# Altium schematic sheet Connectors.SchDoc
size A; SheetNumber: 6; SheetTotal: 8
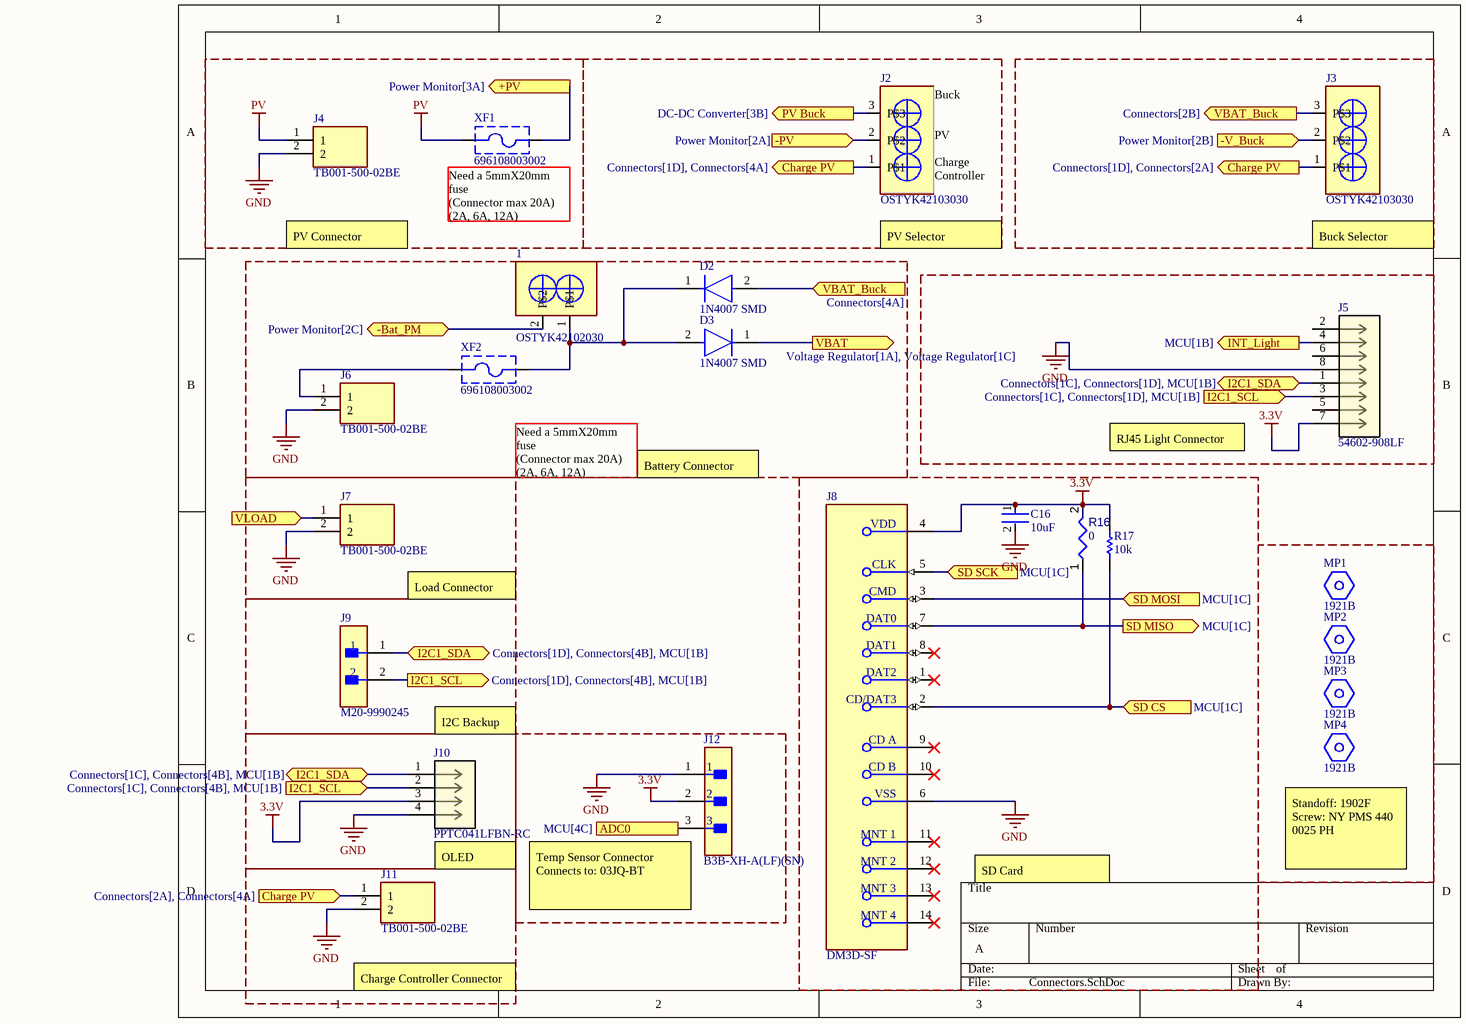
[diagram p0: Connectors.SchDoc]

## Parts
1  OSTYK42102030  [OSTYK42102030]
C16  10uF  [FP-GRM188-0_1-e0_2_0_55-IPC_A]
D2  1N4007 SMD  [FP-1N4007_SMD-IPC_C]
D3  1N4007 SMD  [FP-1N4007_SMD-IPC_C]
J2  OSTYK42103030  [OSTYK42103030]
J3  OSTYK42103030  [OSTYK42103030]
J4  TB001-500-02BE  [CUI_TB001-500-02BE]
J5  54602-908LF  [CONN8_2-908LF_AMP]
J6  TB001-500-02BE  [CUI_TB001-500-02BE]
J7  TB001-500-02BE  [CUI_TB001-500-02BE]
J8  DM3D-SF  [FP-DM3D-SF-MFG]
J9  M20-9990245  [FP-M20-9990245-MFG]
J10  PPTC041LFBN-RC  [CONN_PPTC041LFBN-RC_SUL]
J11  TB001-500-02BE  [CUI_TB001-500-02BE]
J12  B3B-XH-A(LF)(SN)  [FP-B3B-XH-A_LF_SN-MFG]
MP1  1921B  [FP-1921B-MFG]
MP2  1921B  [FP-1921B-MFG]
MP3  1921B  [FP-1921B-MFG]
MP4  1921B  [FP-1921B-MFG]
R16  value 0  [RESC0603(1608)_L]  (hidden comment: 0R3J)
R17  10k  [RESC1609X50X30NL8T20]
XF1  696108003002  [696108003002]
XF2  696108003002  [696108003002]

## Ports
+PV (out, see Power Monitor[3A]), -Bat_PM (bidir, see Power Monitor[2C]), -PV (in, see Power Monitor[2A]), -V_Buck (in, see Power Monitor[2B]), ADC0 (see MCU[4C]), Charge PV (in, see Connectors[2A], Connectors[4A]), Charge PV (out, see Connectors[1D], Connectors[2A]), Charge PV (out, see Connectors[1D], Connectors[4A]), I2C1_SCL (in, see Connectors[1C], Connectors[1D], MCU[1B]), I2C1_SCL (in, see Connectors[1C], Connectors[4B], MCU[1B]), I2C1_SCL (out, see Connectors[1D], Connectors[4B], MCU[1B]), I2C1_SDA (bidir, see Connectors[1C], Connectors[1D], MCU[1B]), I2C1_SDA (bidir, see Connectors[1C], Connectors[4B], MCU[1B]), I2C1_SDA (bidir, see Connectors[1D], Connectors[4B], MCU[1B]), INT_Light (out, see MCU[1B]), PV Buck (out, see DC-DC Converter[3B]), SD CS (in, see MCU[1C]), SD MISO (out, see MCU[1C]), SD MOSI (in, see MCU[1C]), SD SCK (in, see MCU[1C]), VBAT (out, see Voltage Regulator[1A], Voltage Regulator[1C]), VBAT_Buck (in, see Connectors[4A]), VBAT_Buck (out, see Connectors[2B]), VLOAD (in)

## Nets
3.3V: C16.1 J5.7 J8.4(VDD) J10.3 J12.2 R16.2 R17.2
GND: C16.2 J4.2 J5.8 J6.2 J7.2 J8.6(VSS) J10.4 J11.2 J12.1
PV: J4.1 XF1.1
+PV: XF1.2 ; port +PV
-Bat_PM: 1.2(P$2) ; port -Bat_PM
-PV: J2.2(P$2) ; port -PV
-V_Buck: J3.2(P$2) ; port -V_Buck
ADC0: J12.3 ; port ADC0
Charge PV: J2.1(P$1) J3.1(P$1) J11.1 ; port Charge PV
I2C1_SCL: J5.3 J9.2 J10.2 ; port I2C1_SCL
I2C1_SDA: J5.1 J9.1 J10.1 ; port I2C1_SDA
INT_Light: J5.4 ; port INT_Light
PV Buck: J2.3(P$3) ; port PV Buck
SD CS: J8.2(CD/DAT3) R17.1 ; port SD CS
SD MISO: J8.7(DAT0) R16.1 ; port SD MISO
SD MOSI: J8.3(CMD) ; port SD MOSI
SD SCK: J8.5(CLK) ; port SD SCK
VBAT: D3.1(C) ; port VBAT
VBAT_Buck: D2.2(A) J3.3(P$3) ; port VBAT_Buck
VLOAD: J7.1 ; port VLOAD
Net1_1: 1.1(P$1) D2.1(C) D3.2(A) XF2.2
NetJ6_1: J6.1 XF2.1

Not connected (* = marked no-connect by the designer): J5 2 5 6; J8 1(DAT2)* 8(DAT1)* 9(CD_A)* 10(CD_B)* 11(MNT_1)* 12(MNT_2)* 13(MNT_3)* 14(MNT_4)*

## Notes on the sheet
- (near XF1) Need a 5mmX20mm fuse
  (Connector max 20A)
  (2A, 6A, 12A)
- Buck
  PV
  Charge Controller
- PV Connector
- PV Selector
- Buck Selector
- Need a 5mmX20mm fuse
  (Connector max 20A)
  (2A, 6A, 12A)
- Battery Connector
- RJ45 Light Connector
- Load Connector
- (near J10) I2C Backup
- (near J10) OLED
- (near J12) Temp Sensor Connector
  Connects to: 03JQ-BT
- SD Card
- (near MP4) Standoff: 1902F
  Screw: NY PMS 440 0025 PH
- Charge Controller Connector

## Library data of the parts
1 = OSTYK42102030: 2 Circuit 0.325 _8.26mm_ Barrier Block Connector, Screws with Captive Plate; MF: On Shore; Value: *; SnapEDA_Link: https://www.snapeda.com/parts/OSTYK42102030/On%20Shore%20Technology%20Inc./view-part/3076180/?ref=snap; Package: None; MP: OSTYK42102030; Availability: Unavailable; Price: None
C16 = CMP-2006-02792-2: Chip Multilayer Ceramic Capacitors for General Purpose, 0603, 10uF, X5R, 15%, 20%, 6.3V / GRM188R60J106ME47D; Packaging: Tape and Reel; Voltage Rating (DC): 6.3V; Width: 0.031inch; Termination: SMD/SMT; Dielectric: X5R; Package Quantity: 4000; Voltage Rating: 6.3V; Capacitance: 10uF; Case/Package: 0603; Min Operating Temperature: -55°C; Voltage: 6.3V; Length: 1.6mm; Thickness: 0.035inch; Lead Free: Lead Free; Depth: 0.8mm; Case Code (Imperial): 0603; Max Operating Temperature: 85°C; Material: Ceramic; Height: 0.8mm; Tolerance: 20%; Mount: Surface Mount; REACH SVHC: No SVHC; Radiation Hardening: No; Case Code (Metric): 1608
D2 D3 = CMP-12389-000001-1: Rectifier, 1Kv, 1A, Do-214Ac Rohs Compliant: Yes
J2 J3 = CMP-002-00251-1: 3 Circuit 0.325 (8.26mm) Barrier Block Connector, Screws with Captive Plate; MF: On Shore; Case/Package: None; Price: None; Value: *; Purchase-URL: https://pricing.snapeda.com/search/part/OSTYK42103030/?ref=eda; Availability: In Stock; SnapEDA_Link: https://www.snapeda.com/parts/OSTYK42103030/On+Shore+Technology+Inc./view-part/?ref=snap; MP: OSTYK42103030; Pins: 3; Design Item ID: OSTYK42103030; Component Type: Standard; Check_prices: https://www.snapeda.com/parts/OSTYK42103030/On+Shore+Technology+Inc./view-part/?ref=eda; Source: OSTYK42103030.SchLib
J4 J6 J7 J11 = TB001-500-02BE: 2~24 Poles, Screw Type, Horizontal, 5.0 Pitch, 22~12 (AWG), Terminal Block Connector; MF: CUI Devices; Purchase-URL: https://pricing.snapeda.com/search/part/TB001-500-02BE/?ref=eda; CUI_purchase_URL: https://www.cuidevices.com/product/interconnect/connectors/terminal-blocks/tb001-500-series?utm_source=snapeda.com&utm_medium=referral&utm_campaign=snapedaBOM; Check_prices: https://www.snapeda.com/parts/TB001-500-02BE/CUI+Devices/view-part/?ref=eda; SnapEDA_Link: https://www.snapeda.com/parts/TB001-500-02BE/CUI+Devices/view-part/?ref=snap; Value: *; Digi-Key_Part_Number: 102-6134-ND; Package: None; MP: TB001-500-02BE
J5 = 54602-908LF: No Description Available; Mfr_Name: Amphenol ICC; RefDes: RefDes; Type: Type
J8 = CMP-2000-06166-2: CONN MICRO SD CARD PUSH-PULL; Insulation Resistance: 1GR; Max Voltage Rating (AC): 125V; Gender: Female; Contact Resistance: 100mR; Current Rating: 500mA; Pitch: 1.1mm; Connector Type: Connector; Number of Contacts: 8; Contact Plating: Gold; Number of Rows: 1; Termination: Solder; Contact Material: Copper Alloy; REACH SVHC: No SVHC; Voltage Rating (AC): 125V; Packaging: Tape and Reel; Housing Material: Polymer; Max Operating Temperature: 85°C; Package Quantity: 1; Min Operating Temperature: -25°C; Lead Free: Lead Free; Orientation: Right Angle; Radiation Hardening: No; Flammability Rating: UL94 V-0; Mount: Surface Mount; Depth: 11.45mm; Max Current Rating: 500mA; Length: 11.95mm; Width: 11.95mm
J9 = CMP-15831-000105-1: CONN HEADER VERT 2POS 2.54MM; Working Voltage: 750V; Gender: Male; Number of Poles: 2; Current Rating: 3A; Mated Stacking Heights: 16.54mm; Contact Resistance: 25mR; Connector Type: Male Pin; Insulation Resistance: 10GR; Mating Cycles: 300; Voltage: 50V; Flammability Rating: UL94 V-0; Pitch: 2.54mm; Series: M20; Number of Contacts: 2; Height: 0.12inch; Min Operating Temperature: -40°C; Contact Finish - Mating: GOLD; Number of Positions: 2; Number of Rows: 1; Packaging: Bulk; Package Quantity: 1000; Voltage Rating (AC): 750V; Current: 3A; Mount: Through Hole; Case/Package: SIL; Orientation: Straight; Contact Shape: Square; Weight: 0.25lb; Radiation Hardening: No; Fastening Type: Pull; Length: 5.08mm; Depth: 2.54mm; Contact Mating Length: 0.24inch; Housing Material: Nylon; Reach SVHC Compliant: Yes; Insulation Material: Nylon; Color: Black; Width: 0.25inch; Insulation Color: Black; Contact Material: Brass; Contact Type: Male Pin; Termination: Solder; Max Operating Temperature: 105°C; Contact Plating: Gold; Housing Color: Black; Max Current Rating: 3A; Lead Pitch: 2.54mm
J10 = PPTC041LFBN-RC: No Description Available; Mfr_Name: Sullins; RefDes: RefDes; Type: Type
J12 = CMP-17439-000014-3: CONN HEADER VERT 3POS 2.5MM; Max Voltage Rating (DC): 250V; Number of Positions: 3; Current Rating: 3A; Gender: Male; Wire/Cable Gauge: 22AWG; Contact Resistance: 20mR; Insulation Resistance: 1GR; Insulation Material: Nylon; Contact Plating: Tin; Depth: 5.75mm; Contact Type: Male Pin; Max Operating Temperature: 85°C; Insulation Color: Natural; Voltage Rating (AC): 250V; Color: Natural; Connector Type: Header; Orientation: Straight; Fastening Type: Detent; Housing Color: White; Min Operating Temperature: -25°C; Termination: Solder; Voltage Rating: 250V; Series: XH; Pitch: 2.5mm; Contact Shape: Square; Number of Rows: 1; Lead Free: Lead Free; Packaging: Bulk; Mount: Through Hole; Flammability Rating: UL94 V-0; Max Voltage Rating (AC): 250V; REACH SVHC: No SVHC; Housing Material: Polyamide; Contact Material: Brass; Lead Pitch: 2.5mm; Contact Finish - Mating: TIN; Length: 9.9mm; Max Current Rating: 3A; Number of Contacts: 3
MP1-MP4 = CMP-00214-00374361-1: 1921B Standoff, 1/4 Hex, Female, Threaded 4-40, Length .500, Stainless Steel; NexarPartId: 374361; Outside Diameter: 6.35mm; Gender: Female, Female; Length: 12.7mm; Threaded/Unthreaded: Threaded; Width: 6.35mm; Color: Natural; Shape: Hex; RoHS: Compliant; Lead Free: Lead Free; Material: Stainless Steel; Height: 12.827mm; Diameter: 6.35mm
R16 = CMP-009-00063-2: Jumper 0603 (1608 Metric); Case/Package: 0603; Mounting Technology: SMT; Pins: 2
R17 = CMP-1666-00005-4: Chip Resistor, 10 KOhm, +/- 1%, 100 mW, -55 to 155 degC, 0603 (1608 Metric), RoHS, Tape and Reel; Manufacturer: Vishay Semiconductor; Voltage Rating: 75 V; Max Operating Temperature: 155 degC; PackageDescription: 2-Pin Surface Mount Device, Body 1.575 x 0.85 mm; ComponentLink1Description: Manufacturer URL; RoHSCompliant: true; PackageReference: 0603; REACH SVHC: Unknown; Length: 1.55 mm; DatasheetVersion: 06/2012; Packaging: Tape and Reel; Min Operating Temperature: -55 degC; Mounting Technology: Surface Mount; ComponentLink2URL: https://datasheet.ciiva.com/11809/0900766b80d98afc-11809037.pdf; Height: 0.45 mm; ComponentLink2Description: Datasheet; Package Quantity: 5000; ComponentLink1URL: http://www.vishay.com/
XF1 XF2 = CMP-1502-00237-2: NexarPartId: 56808807; Voltage Rating (AC): 250V; Fuse Current: 10A; REACH SVHC: Unknown; RoHS: Non-Compliant; Mount: Through Hole; Packaging: Box